# EAGLE design untitled (EAGLE 4.16)
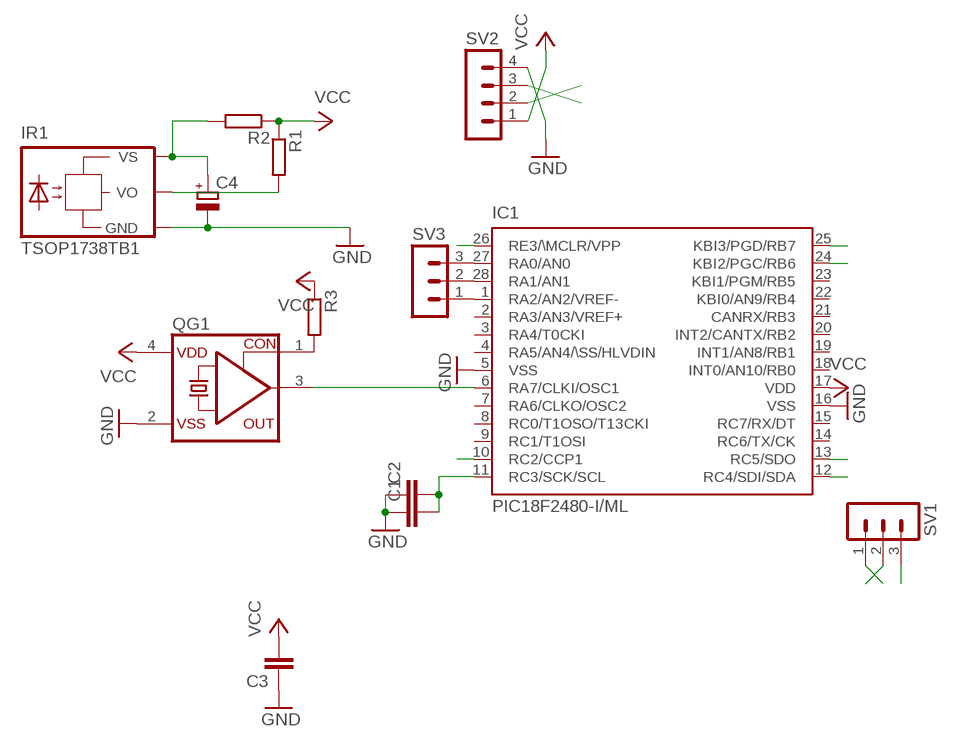
[diagram p0: schematic, sheet 1]

## Parts
C1  C-EUC0603  [C0603]
C2  C-EUC0603  [C0603]
C3  C-EUC0603  [C0603]
C4  CPOL-EUE2,5-6E  [E2,5-6E]
IC1  PIC18F2480-I/ML  [QFN28-ML_6X6MM]
IR1  TSOP1738TB1  [TSOP17_TB1]
QG1  CRYSTAL_RES-1100S  [1100S]
R1  R-EU_R0805  [R0805]
R2  R-EU_R0805  [R0805]
R3  R-EU_R0805  [R0805]
SV1  MA03-1  [MA03-1]
SV2  MA04-1  [MA04-1]
SV3  MA03-1  [MA03-1]

## Nets
CLOCK: IC1.6(RA7/CLKI/OSC1) QG1.3(OUT)
D+: IC1.13(RC5/SDO) SV2.3
D-: IC1.12(RC4/SDI/SDA) SV2.2
GND: C1.1 C2.1 C3.1 C4.- IC1.5(VSS) IC1.16(VSS) IR1.GND QG1.2(VSS) SV2.4
IRDATA: IC1.10(RC2/CCP1) IR1.VO R1.2
MCLR: IC1.26(RE3/\MCLR/VPP) SV1.3
N$1: C1.2 C2.2 IC1.11(RC3/SCK/SCL)
N$2: C4.+ IR1.VS R2.2
N$3: QG1.1(CON) R3.2
N$4: IC1.1(RA2/AN2/VREF-) SV3.1
N$5: IC1.28(RA1/AN1) SV3.2
N$6: IC1.27(RA0/AN0) SV3.3
PGC: IC1.24(KBI2/PGC/RB6) SV1.1
PGD: IC1.25(KBI3/PGD/RB7) SV1.2
VCC: C3.2 IC1.17(VDD) QG1.4(VDD) R1.1 R2.1 R3.1 SV2.1
Unconnected: IC1.2(RA3/AN3/VREF+) IC1.3(RA4/T0CKI) IC1.4(RA5/AN4/\SS/HLVDIN) IC1.7(RA6/CLKO/OSC2) IC1.8(RC0/T1OSO/T13CKI) IC1.9(RC1/T1OSI) IC1.14(RC6/TX/CK) IC1.15(RC7/RX/DT) IC1.18(INT0/AN10/RB0) IC1.19(INT1/AN8/RB1) IC1.20(INT2/CANTX/RB2) IC1.21(CANRX/RB3) IC1.22(KBI0/AN9/RB4) IC1.23(KBI1/PGM/RB5)

## Library data of the parts
C1-C3 = rcl:C-EU: CAPACITOR, European symbol
C4 = rcl:CPOL-EU: POLARIZED CAPACITOR, European symbol
IC1 = microchip:PIC18F2*80: 28-Pin Enhanced Flash Microcontrollers with ECAN(TM) Technology 10-Bit A/D and nanoWatt Technology Source: http://www.microchip.com .. 39637a.pdf
IR1 = telefunken:TSOP17*TB1: TSOP17..TB1 IR Receiver Modules for Remote Control Systems Source: http://www.vishay.com/docs/82042/82042.pdf
QG1 = crystal:CRYSTAL_RES-: CRYSTAL RESONATOR
R1-R3 = rcl:R-EU_: RESISTOR, European symbol
SV1 SV3 = con-lstb:MA03-1: PIN HEADER
SV2 = con-lstb:MA04-1: PIN HEADER

## Board
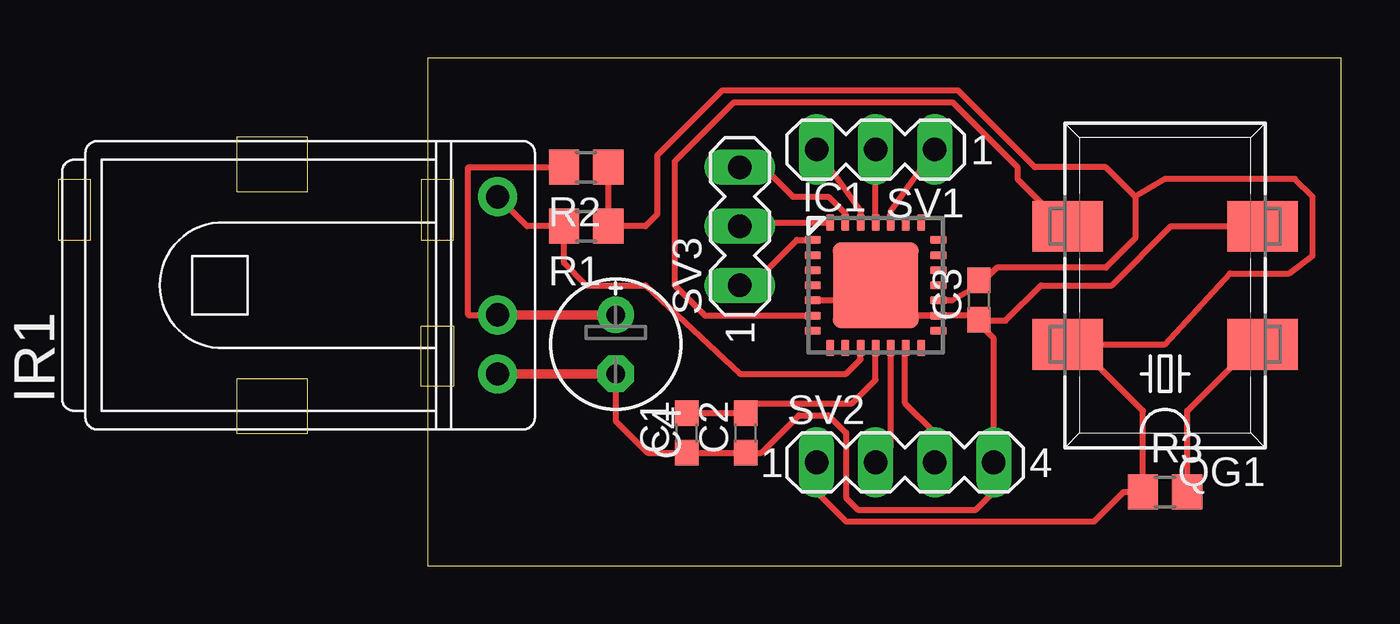
[diagram p1: board, top side]

Size 39.29 x 21.83 mm. Coordinates in mm from the lower left corner, seen from the top.
Outline: 0,0 39.29,0 39.29,21.83 0,21.83 0,0
Copper layers (1*16): Top 0.035mm / dielectric 1.5mm / Bottom 0.035mm
Design rules "default": minimum track width 10mil, minimum drill 24mil, track to track 8mil, track to pad 8mil, pad to pad 8mil, via to via 8mil, smd to smd 8mil, copper to edge 40mil, drill to drill 8mil, minimum pad ring 10mil, minimum via ring 8mil, stop-mask expansion 4mil, vias tented up to drill 0mil, thermal gap 10mil

### Footprints (pad centres in the part's own frame; a part is rotated, then mirrored left to right if it is on the bottom)
C0603 = smd 1.1 x 1: 1 -0.85,0; 2 0.85,0
E2,5-6E = drill 0.813 pad 1.575 round: + -1.27,0 | drill 0.813 pad 1.575 octagon: - 1.27,0
QFN28-ML_6X6MM = smd 0.7 x 0.35: 1 -2.7,1.95; 2 -2.7,1.3; 3 -2.7,0.65; 4 -2.7,0; 5 -2.7,-0.65; 6 -2.7,-1.3; 7 -2.7,-1.95; 15 2.7,-1.95; 16 2.7,-1.3; 17 2.7,-0.65; 18 2.7,0; 19 2.7,0.65; 20 2.7,1.3; 21 2.7,1.95 | smd 0.35 x 0.7: 8 -1.95,-2.7; 9 -1.3,-2.7; 10 -0.65,-2.7; 11 0,-2.7; 12 0.65,-2.7; 13 1.3,-2.7; 14 1.95,-2.7; 22 1.95,2.7; 23 1.3,2.7; 24 0.65,2.7; 25 0,2.7; 26 -0.65,2.7; 27 -1.3,2.7; 28 -1.95,2.7 | smd 3.7 x 3.7: EXP 0,0
TSOP17_TB1 = drill 1 pad 1.676 round: GND 0,-3.81; VO 0,3.81; VS 0,-1.27
1100S = smd 2.184 x 3.048: 1 -2.54,-4.191; 2 2.54,-4.191; 3 2.54,4.191; 4 -2.54,4.191
R0805 = smd 1.3 x 1.5: 1 -0.95,0; 2 0.95,0
MA03-1 = drill 1.016 long: 1 -2.54,0; 2 0,0; 3 2.54,0
MA04-1 = drill 1.016 long: 1 -3.81,0; 2 -1.27,0; 3 1.27,0; 4 3.81,0

### Placement (x,y rotation side)
C1  11.14,5.71 90 top
C2  13.68,5.71 90 top
C3  23.71,11.42 90 top
C4  8.09,9.52 270 top
IC1  19.27,12.06 0 top
IR1  3.01,12.06 0 top
QG1  31.71,12.06 90 top
R1  6.82,14.6 180 top
R2  6.82,17.14 180 top
R3  31.71,3.17 0 top
SV1  19.27,17.9 180 top
SV2  20.54,4.44 0 top
SV3  13.42,14.6 90 top

### Tracks (layer width: path | path; a pad name or v marks a point on that pad's centre or on a via)
CLOCK
  Top 0.254: IC1.6 11.93,10.76 10.63,12.06 10.63,17.39 13.17,19.93 22.57,19.93 25.36,17.14 25.36,16.63 27.39,14.6 QG1.3
D+
  Top 0.254: SV2.3 21.81,5.71 20.54,6.98 20.54,9.52 20.57,9.49 IC1.13
D-
  Top 0.254: IC1.12 19.92,5.09 SV2.2
GND
  Top 0.254: 20.06,10.76 IC1.16 23.61,10.76 23.84,10.54 | IC1.5 19.41,11.41 20.06,10.76 | C4.- 8.09,6.22 9.45,4.86 C1.1 11.14,4.95 11.23,4.86 C2.1 14.35,4.86 15.96,6.47 17.23,6.47 18,5.71 18,2.92 18.5,2.41 23.58,2.41 24.35,3.17 SV2.4 24.35,9.77 23.58,10.54 | QG1.2 31.97,14.6 29.43,12.06 26.38,12.06 24.85,10.54 23.84,10.54 | 23.58,10.54 23.84,10.54 | 23.84,10.54 23.8,10.57 C3.1 23.62,10.57 23.58,10.54 | 20.06,10.76 21.58,10.76
  Top 0.406: IR1.GND C4.-
IRDATA
  Top 0.254: IR1.VO 4.28,14.6 R1.2 5.87,13.01 6.82,12.06 9.36,12.06 13.42,8.25 18,8.25 18.62,8.87 IC1.10
MCLR
  Top 0.254: IC1.26 18.62,15.25 SV1.3
N$1
  Top 0.254: IC1.11 19.27,8 18.25,6.98 13.93,6.98 13.68,6.73 C2.2 11.23,6.56 11.14,6.47 C1.2
N$2
  Top 0.254: C4.+ 5.55,10.79 | R2.2 1.74,17.14 1.74,10.79 IR1.VS
  Top 0.406: IR1.VS C4.+
N$3
  Top 0.254: QG1.1 35.52,9.52 32.66,6.66 R3.2
N$4
  Top 0.254: IC1.1 15.88,14.01 13.93,12.06 SV3.1
N$5
  Top 0.254: IC1.28 13.42,14.76 SV3.2
N$6
  Top 0.254: IC1.27 17.97,15.14 17.23,15.87 15.71,15.87 14.44,17.14 SV3.3 13.17,17.14
PGC
  Top 0.254: IC1.24 19.92,15.25 SV1.1
PGD
  Top 0.254: IC1.25 SV1.2
VCC
  Top 0.254: IC1.17 22.55,11.41 23.71,12.06 24.47,12.82 29.17,12.82 30.44,14.09 30.44,15.87 | 27.9,9.52 QG1.4 | 27.9,9.52 30.76,6.66 R3.1 29.93,3.17 28.66,1.9 18,1.9 16.73,3.17 SV2.1 | R2.1 8.09,17.14 7.77,16.82 R1.1 9.36,14.6 9.87,15.11 9.87,17.65 12.66,20.44 22.82,20.44 26.12,17.14 29.17,17.14 30.44,15.87 | 27.9,9.52 31.71,9.52 34.51,12.57 37.05,12.57 38.06,13.33 38.06,15.87 37.3,16.63 31.71,16.63 30.44,15.87
  Top 0.406: 23.71,12.06 C3.2